# Altium schematic sheet PSU_MGTAVTT_Buck.SchDoc
size A3; SheetNumber: 8; SheetTotal: 32
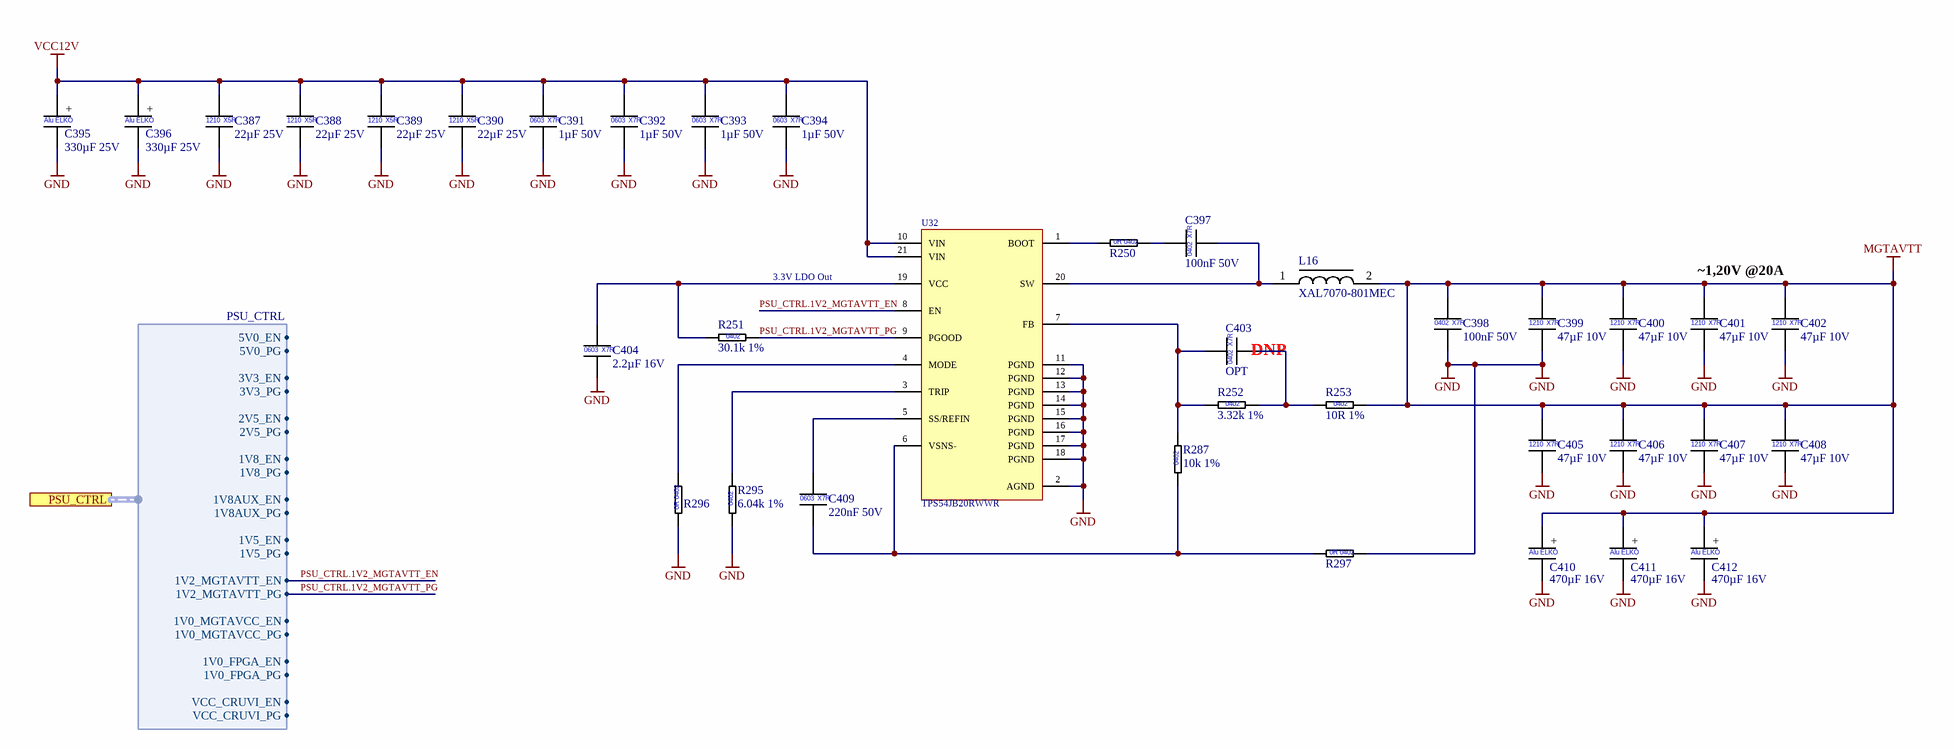
[diagram p0: PSU_MGTAVTT_Buck.SchDoc]

## Parts
C387  22µF 25V  [CAP_1210]
C388  22µF 25V  [CAP_1210]
C389  22µF 25V  [CAP_1210]
C390  22µF 25V  [CAP_1210]
C391  1µF 50V  [CAP_0603]
C392  1µF 50V  [CAP_0603]
C393  1µF 50V  [CAP_0603]
C394  1µF 50V  [CAP_0603]
C395  330µF 25V  [WCAP-PTG5_D10H12.5]
C396  330µF 25V  [WCAP-PTG5_D10H12.5]
C397  100nF 50V  [CAP_0402]
C398  100nF 50V  [CAP_0402]
C399  47µF 10V  [CAP_1210]
C400  47µF 10V  [CAP_1210]
C401  47µF 10V  [CAP_1210]
C402  47µF 10V  [CAP_1210]
C403  OPT  [CAP_0402]  (no BOM)
C404  2.2µF 16V  [CAP_0603]
C405  47µF 10V  [CAP_1210]
C406  47µF 10V  [CAP_1210]
C407  47µF 10V  [CAP_1210]
C408  47µF 10V  [CAP_1210]
C409  220nF 50V  [CAP_0603]
C410  470µF 16V  [WCAP-PTG5_D8H13]
C411  470µF 16V  [WCAP-PTG5_D8H13]
C412  470µF 16V  [WCAP-PTG5_D8H13]
L16  XAL7070-801MEC  [COILCRAFT_XAL7070]
R250  0R Jumper  [RES_0402]  (value not drawn)
R251  30.1k 1%  [RES_0402]
R252  3.32k 1%  [RES_0402]
R253  10R 1%  [RES_0402]
R287  10k 1%  [RES_0402]
R295  6.04k 1%  [RES_0402]
R296  0R Jumper  [RES_0402]  (value not drawn)
R297  0R Jumper  [RES_0402]  (value not drawn)
U32  TPS54JB20RWWR  [VQFN-HR21_RWW0021A]

## Ports
PSU_CTRL (harness PSU_CTRL, see Power-Tree[2C], PSU_MGTAVCC_Buck[1B], PSU_VCC1V0_FPGA_Buck[1B], PSU_VCC1V5_Buck[1B], PSU_VCC1V8_Buck[1B], PSU_VCC1V8AUX_Buck[1B], PSU_VCC2V5_Buck[1B], PSU_VCC3V3_Buck[1B], PSU_VCC5V_Buck[1B], PSU_VCC_CRUVI_ADJ_Buck[1B])

## Harnesses
PSU_CTRL: 5V0_EN, 5V0_PG, 3V3_EN, 3V3_PG, 2V5_EN, 2V5_PG, 1V8_EN, 1V8_PG, 1V8AUX_EN, 1V8AUX_PG, 1V5_EN, 1V5_PG, 1V2_MGTAVTT_EN, 1V2_MGTAVTT_PG, 1V0_MGTAVCC_EN, 1V0_MGTAVCC_PG, 1V0_FPGA_EN, 1V0_FPGA_PG, VCC_CRUVI_EN, VCC_CRUVI_PG

## Nets
GND: C387.2 C388.2 C389.2 C390.2 C391.2 C392.2 C393.2 C394.2 C395.2 C396.2 C398.2 C399.2 C400.2 C401.2 C402.2 C404.2 C405.2 C406.2 C407.2 C408.2 C410.2 C411.2 C412.2 R295.1 R296.1 R297.2 U32.2(AGND) U32.11(PGND) U32.12(PGND) U32.13(PGND) U32.14(PGND) U32.15(PGND) U32.16(PGND) U32.17(PGND) U32.18(PGND)
MGTAVTT: C398.1 C399.1 C400.1 C401.1 C402.1 C405.1 C406.1 C407.1 C408.1 C410.1 C411.1 C412.1 L16.2 R253.2
VCC12V: C387.1 C388.1 C389.1 C390.1 C391.1 C392.1 C393.1 C394.1 C395.1 C396.1 U32.10(VIN) U32.21(VIN)
PSU_CTRL.1V2_MGTAVTT_EN: U32.8(EN) ; port PSU_CTRL.1V2_MGTAVTT_EN
PSU_CTRL.1V2_MGTAVTT_PG: R251.2 U32.9(PGOOD) ; port PSU_CTRL.1V2_MGTAVTT_PG
NetC397_1: C397.1 R250.2
NetC397_2: C397.2 L16.1 U32.20(SW)
NetC403_1: C403.1 R252.1 R287.2 U32.7(FB)
NetC403_2: C403.2 R252.2 R253.1
NetC404_1: C404.1 R251.1 U32.19(VCC)
NetC409_1: C409.1 U32.5(SS/REFIN)
NetC409_2: C409.2 R287.1 R297.1 U32.6(VSNS-)
NetR250_1: R250.1 U32.1(BOOT)
NetR295_2: R295.2 U32.3(TRIP)
NetR296_2: R296.2 U32.4(MODE)

## Notes on the sheet
- 3.3V LDO Out
- (near C402) ~1,20V @20A
- (near C403) DNP
- Company:
- Contact:
- Customer:
- mail@pcb-arts.com
- PCB Arts GmbH
- Title:
- Project:
- The  information  contained  in  these  documents  is  confidential,  privileged  and  only  for  the information of the intended recipient and may not be used, published or redistributed Without the prior written consent from PCB Arts GmbH.
- Engineer:
- Document Number:
- Revision:
- Variant:
- Date:
- Time:
- Sheet:
- Status:
- /
- (in symbol CAP_0402_100nF_50V) X7R; 0402
- (in symbol CAP_0402_OPT) X7R; 0402
- (in symbol CAP_0603_1µF_50V_X7R_10%) 0603; X7R
- (in symbol CAP_0603_2.2µF_16V_X7R_10%) 0603; X7R
- (in symbol CAP_0603_220nF_50V_X7R_10%) 0603; X7R
- (in symbol CAP_1210_22µF_25V) 1210; X5R
- (in symbol CAP_1210_47µF_10V_X7R_10%) 1210; X7R
- (in symbol CAP_D8L9_470µF_16V) +; Alu ELKO
- (in symbol CAP_D10L12.5_330µF_25V) +; Alu ELKO
- (in symbol RES_0402_0R Jumper) 0R 0402
- (in symbol RES_0402_3.32k_1%) 0402
- (in symbol RES_0402_6.04k_1%) 0402
- (in symbol RES_0402_10k_1%) 0402
- (in symbol RES_0402_10R_1%) 0402
- (in symbol RES_0402_30.1k_1%) 0402

## Library data of the parts
C387-C390 = CAP_1210_22µF_25V: Multilayer Ceramic Capacitors MLCC - SMD/SMT 1210 25VDC; Manufacturer 1: KEMET; Manufacturer 1 Prt. Nr.: C1210C226K3PACTU; Manufacturer 2 Prt. Nr.: TMK212BBJ226MG-TT; Manufacturer 2: Taiyo Yuden
C391-C394 = CAP_0603_1µF_50V_X7R_10%: Multilayer Ceramic Capacitors MLCC - SMD/SMT 50V 1uF X7R 0603 10%; Manufacturer 1: KYOCERA AVX; Manufacturer 1 Prt. Nr.: 06035C105KAT2A; Manufacturer 2 Prt. Nr.: MSASU168AB7105KTNA01; Manufacturer 2: TAIYO YUDEN
C395 C396 = CAP_D10L12.5_330µF_25V: Organische Polymer-Aluminiumkondensatoren 330uF 25 Volts 20% AEC-Q200; Manufacturer 1: Würth Elektronik; Manufacturer 1 Prt. Nr.: 870025575009
C397 C398 = CAP_0402_100nF_50V: Multilayer Ceramic Capacitors MLCC - SMD/SMT 0402 50VDC; Manufacturer 1: Murata Electronics; Manufacturer 1 Prt. Nr.: GCM155L8EH104KE07D; Manufacturer 2 Prt. Nr.: UMK105B7104KV-FR; Manufacturer 2: TDK
C399-C402 C405-C408 = CAP_1210_47µF_10V_X7R_10%: Multilayer Ceramic Capacitors MLCC - SMD/SMT 47 uF 10 VDC 10% 1210 X7R; Manufacturer 1: Murata Electronics; Manufacturer 1 Prt. Nr.: GRM32ER71A476KE15L; Manufacturer 2 Prt. Nr.: C1210C106K8RACTU; Manufacturer 2: KEMET
C403 = CAP_0402_OPT: Multilayer Ceramic Capacitors MLCC - SMD/SMT 0402 Optional Placeholder
C404 = CAP_0603_2.2µF_16V_X7R_10%: Multilayer Ceramic Capacitors MLCC - SMD/SMT 2.2 uF 16 VDC 10% 0603 X7R; Manufacturer 1: Murata Electronics; Manufacturer 1 Prt. Nr.: GRM188Z71C225KE43D; Manufacturer 2 Prt. Nr.: EMK107BB7225KA-T; Manufacturer 2: TAIYO YUDEN
C409 = CAP_0603_220nF_50V_X7R_10%: Multilayer Ceramic Capacitors MLCC - SMD/SMT 0.22 uF 50 VDC 10% 0603 X7R; Manufacturer 1: Murata Electronics; Manufacturer 1 Prt. Nr.: GRJ188R71H224KE11D; Manufacturer 2 Prt. Nr.: CGA3E3X7R1H224K080AE; Manufacturer 2: TDK
C410-C412 = CAP_D8L9_470µF_16V: Organische Polymer-Aluminiumkondensatoren 470uF 16 Volts 20%; Manufacturer 1: Würth Elektronik; Manufacturer 1 Prt. Nr.: 870025374007
L16 = XAL7070-801MEC_Power Inductors SMD 800nH Shld 20% 25.8A 2.29mOhms AECQ200: Power Inductors - SMD 800nH Shld 20% 25.8A 2.29mOhms AECQ200; Manufacturer 1: Coilcraft; Manufacturer 1 Prt. Nr.: XAL7070-801MEC
R250 R296 R297 = RES_0402_0R Jumper: Thick Film Resistors - SMD 0Ohm; Manufacturer 1: Vishay / Dale; Manufacturer 1 Prt. Nr.: CRCW04020000Z0EDC; Manufacturer 2 Prt. Nr.: RC0402JR-070RL; Manufacturer 2: Yageo
R251 = RES_0402_30.1k_1%: Thick Film Resistors - SMD 30.1kOhm 1%; Manufacturer 1: Vishay / Dale; Manufacturer 1 Prt. Nr.: CRCW040230K1FKEDC; Manufacturer 2 Prt. Nr.: RC0402FR-1330K1L; Manufacturer 2: Yageo
R252 = RES_0402_3.32k_1%: Thick Film Resistors - SMD 3.32kOhm 1%; Manufacturer 1: Vishay / Dale; Manufacturer 1 Prt. Nr.: CRCW04023K32FKEDC; Manufacturer 2 Prt. Nr.: AC0402FR-073K32L; Manufacturer 2: Yageo
R253 = RES_0402_10R_1%: Thick Film Resistors - SMD 10Ohm 1%; Manufacturer 1: Vishay / Dale; Manufacturer 1 Prt. Nr.: CRCW040210R0FKEE; Manufacturer 2 Prt. Nr.: RC0402FR-7W10RL; Manufacturer 2: Yageo
R287 = RES_0402_10k_1%: Thick Film Resistors - SMD 10kOhm 1%; Manufacturer 1: Vishay / Dale; Manufacturer 1 Prt. Nr.: CRCW040210K0FKEDC; Manufacturer 2 Prt. Nr.: RC0402FR-7W10KL; Manufacturer 2: Yageo
R295 = RES_0402_6.04k_1%: Thick Film Resistors - SMD 6.04kOhm 1%; Manufacturer 1: Vishay / Dale; Manufacturer 1 Prt. Nr.: CRCW04026K04FKEDC; Manufacturer 2 Prt. Nr.: RC0402FR-7W6K04L; Manufacturer 2: Yageo
U32 = TPS54JB20RWWR_Switching Voltage Regulators 2.7-V to 16-V input 20-A synchronous Buck: Switching Voltage Regulators 2.7-V to 16-V input 20-A synchronous Buck; Manufacturer 1: Texas Instruments; Manufacturer 1 Prt. Nr.: TPS54JB20RWWR